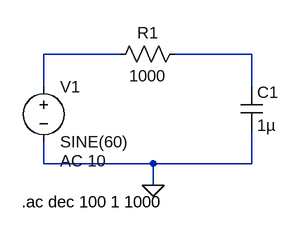
[diagram p0: schematic rc.asc]
rc.asc, the LTspice schematic file:
Version 4.1
SHEET 1 880 680
WIRE 64 112 -48 112
WIRE 256 112 144 112
WIRE -48 160 -48 112
WIRE 256 160 256 112
WIRE -48 272 -48 240
WIRE 112 272 -48 272
WIRE 256 272 256 224
WIRE 256 272 112 272
WIRE 112 304 112 272
FLAG 112 304 0
SYMBOL res 160 96 R90
WINDOW 0 0 56 VBottom 2
WINDOW 3 32 56 VTop 2
SYMATTR InstName R1
SYMATTR Value 1000
SYMBOL cap 240 160 R0
SYMATTR InstName C1
SYMATTR Value 1µ
SYMBOL voltage -48 144 R0
WINDOW 123 24 124 Left 2
WINDOW 39 0 0 Left 0
SYMATTR InstName V1
SYMATTR Value SINE(60)
SYMATTR Value2 AC 10
TEXT -80 328 Left 2 !.ac dec 100 1 1000

The netlist it stands for:
* rc.asc
R1 N002 N001 1000
C1 N002 0 1µ
V1 N001 0 SINE(60) AC 10
.ac dec 100 1 1000
.backanno
.end